# EAGLE design OPEnS-Power-7.2 (EAGLE 9.3.1)
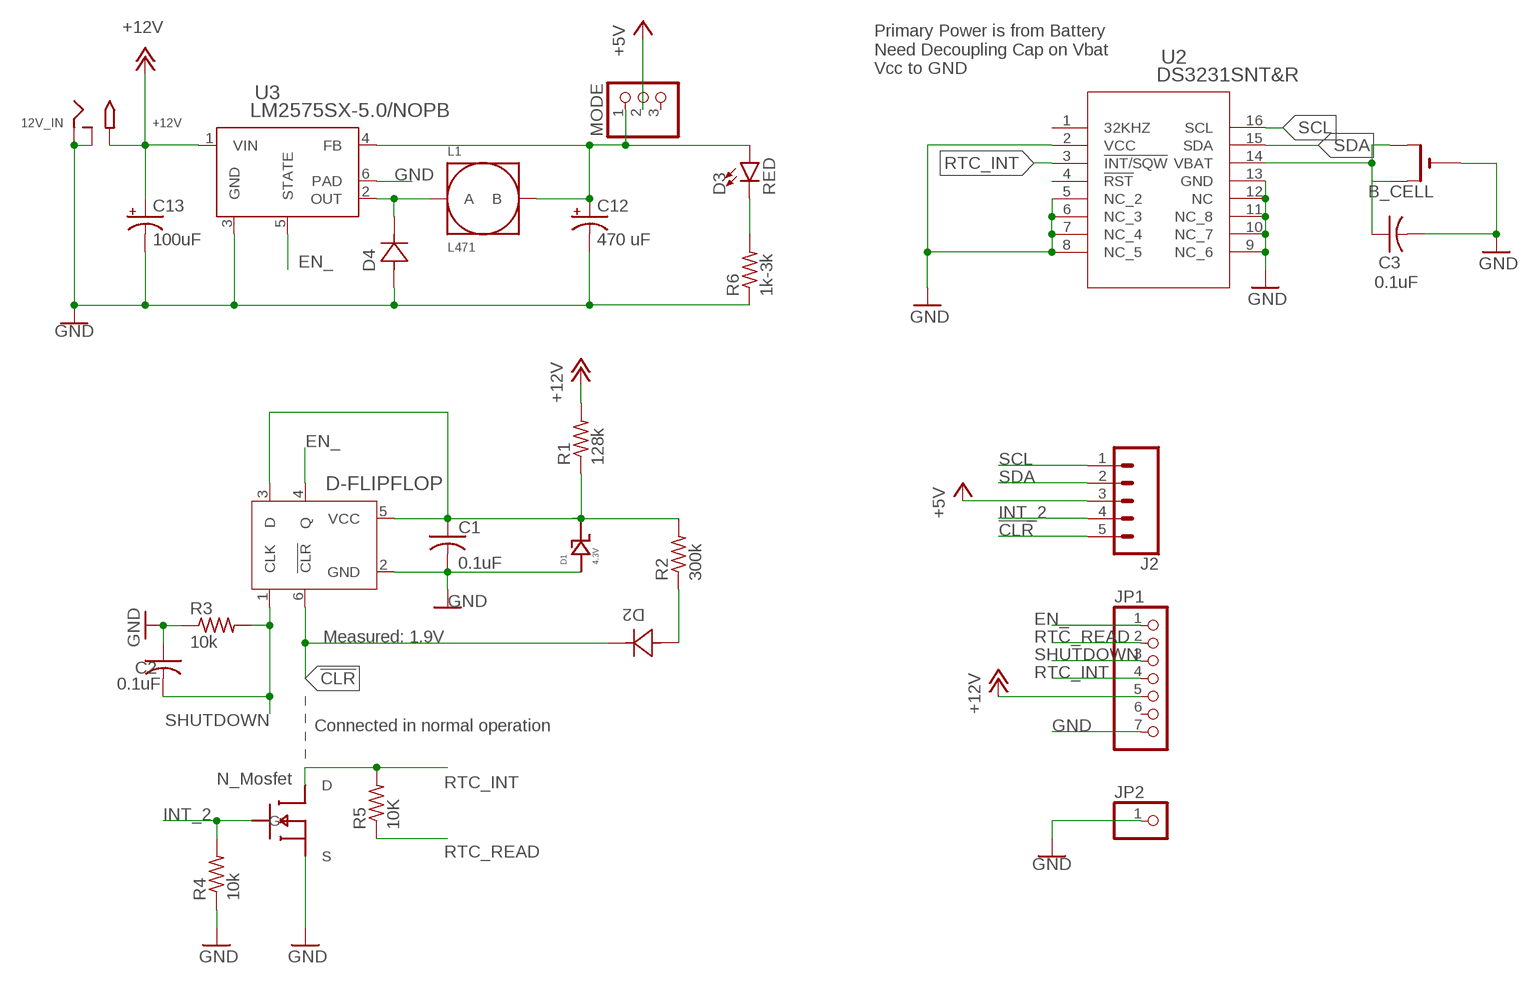
[diagram p0: schematic, sheet 1]

## Parts
12V_IN  2.1MMJACKSMT  [DCJACK_2MM_SMT]
B_CELL  CR1220SMT  [CR1220-SMD]
C1  0.1uF  C-USC1206  [C1206]
C2  0.1uF  C-USC1206  [C1206]
C3  0.1uF  C-USC1206  [C1206]
C12  470 uF  CPOL-US153CLV-0810  [153CLV-0810]
C13  100uF  CPOL-US153CLV-0505  [153CLV-0505]
D1  4.3V  ZENER-DO219  [DO-219AC]
D2  S1A-13-F  [SMA]
D3  RED  LED-RED1206  [LED-1206]
D4  S1A-13-F  [SMA]
D-FLIPFLOP  SN74LVC1G175DBVR  [DBV6]
J2  CONN_05  [1X05]
JP1  PINHD-1X7  [1X07]
JP2  PINHD-1X1  [1X01]
L1  L471  [12-12]
MODE  PINHD-1X3  [1X03]
MOSFET  MOSFET-SOT23F  [SOT-23F]
R1  128k  R-US_R1206  [R1206]
R2  300k  R-US_R1206  [R1206]
R3  10k  R-US_R1206  [R1206]
R4  10k  R-US_R1206  [R1206]
R5  10K  R-US_R1206  [R1206]
R6  1k-3k  R-US_R1206  [R1206]
U2  DS3231SNT&R  [21-0042B_16]
U3  LM2575SX-5.0/NOPB  [KTT0005B]

## Nets
5_RAW [5v]: C12.+ D3.A L1.B MODE.1 U3.4(FB)
!CLR [sig]: D2.1 D-FLIPFLOP.6(!CLR) J2.5
+5V [5v]: J2.3 MODE.2
+12V: 12V_IN.PWR2(TIP) C13.+ JP1.5 R1.2 U3.1(VIN)
EN_ [sig]: D-FLIPFLOP.4(Q) JP1.1 U3.5(STATE)
GND: 12V_IN.GND(RING) 12V_IN.GNDBREAK(RING_SW) B_CELL.- C1.2 C2.1 C3.2 C12.- C13.- D1.BCK D4.2 D-FLIPFLOP.2(GND) JP1.7 JP2.1 MOSFET.S R3.1 R4.1 R6.1 U2.2(VCC) U2.5(NC_2) U2.6(NC_3) U2.7(NC_4) U2.8(NC_5) U2.9(NC_6) U2.10(NC_7) U2.11(NC_8) U2.12(NC) U2.13(GND) U3.3(GND) U3.6(PAD)
INT_2: J2.4 MOSFET.G R4.2
N$1 [5v]: D4.1 L1.A U3.2(OUT)
N$2 [sig]: C1.1 D1.FNT D-FLIPFLOP.3(D) D-FLIPFLOP.5(VCC) R1.1 R2.2
N$3: B_CELL.+$1(+) B_CELL.+$2(+1) C3.1 U2.14(VBAT)
N$4 [sig]: D2.2 R2.1
N$7: D3.C R6.2
RTC_INT [sig]: JP1.4 MOSFET.D R5.2 U2.3(!INT/SQW)
RTC_READ: JP1.2 R5.1
SCL: J2.1 U2.16(SCL)
SDA: J2.2 U2.15(SDA)
SHUTDOWN [sig]: C2.2 D-FLIPFLOP.1(CLK) JP1.3 R3.2
Unconnected: JP1.6 MODE.3 U2.1(32KHZ) U2.4(!RST)

## Notes on the sheet
- Primary Power is from Battery
  Need Decoupling Cap on Vbat
  Vcc to GND
- Measured: 1.9V
- Connected in normal operation
- N_Mosfet

## Library data of the parts
12V_IN = adafruit:2.1MMJACK: 2.1mm x 5.5mm THM DC jack with internal switch. Digikey part #PJ-102A, 4UCON part #05537 2.1mm x 5.5mm SMT DC jack with internal switch. Digikey part #PJ-002A-SMT, 4UCON part #03267 By microbuilder.eu & adafruit.com
B_CELL = adafruit:CR1220: CR1216/CR1220/CR1225 12mm 3V lithium coin cell Great for battery packup. Both SMT and THM holders. Note the THM package has the ground pads on both sides of the PCB so that the masks are the same - this reduces the cost
C1-C3 = adafruit:C-US: CAPACITOR, American symbol
C12 = rcl:CPOL-US: POLARIZED CAPACITOR, American symbol; SPICEPREFIX: C
C13 = adafruit:CPOL-US: POLARIZED CAPACITOR, American symbol
D1 = beach:ZENER-DO219
D2 D4 = eDNA:S1A-13-F: General SMD diode 50V 1A https://www.digikey.com/product-detail/en/diodes-incorporated/S1A-13-F/S1A-FDICT-ND/750031; MANUFACTURER_PART_NUMBER: S1A13F; VENDOR: Diodes Inc
D3 = SparkFun-LED:LED-RED: Red SMD LED Used in manufacturing of most products at SparkFun Packages: 0603 - SMD 0603 package [Product Link] <http://docs.avagotech.com/docs/AV02-0551EN> 0603 SMART - SMD 0603 SMART package ( more efficient and expensive)[Product Link] <http://www.osram-os.com/Graphics/XPic2/00077099_0.pdf> 1206 - SMD1206 package [Product Link] <https://www.sparkfun.com/datasheets/DevTools/LilyPad/Q150OVS4.pdff> SparkFun Products: Pro Mini 328 -5V <https://www.sparkfun.com/products/821> RedBoard <https://www.sparkfun.com/products/12757> IOIO-OTG <https://www.sparkfun.com/products/13613>; PROD_ID: DIO-09912
D-FLIPFLOP = eDNA:SN74LVC1G175DBVR: D Flipflop with clear - https://www.digikey.com/product-detail/en/texas-instruments/SN74LVC1G175DBVR/296-17617-1-ND/706599; MANUFACTURER_PART_NUMBER: SN74LVC1G175DBVR; VENDOR: Texas Instruments
J2 = SparkFun-Connectors:CONN_05: Multi connection point. Often used as Generic Header-pin footprint for 0.1 inch spaced/style header connections On any of the 0.1 inch spaced packages, you can populate with these: Break Away Headers - Straight <https://www.sparkfun.com/products/116> (PRT-00116) Break Away Male Headers - Right Angle <https://www.sparkfun.com/products/553> (PRT-00553) Female Headers <https://www.sparkfun.com/products/115> (PRT-00115) Break Away Headers - Machine Pin <https://www.sparkfun.com/products/117> (PRT-00117) Break Away Female Headers - Swiss Machine Pin <https://www.sparkfun.com/products/743> (PRT-00743) For SCREWTERMINALS and SPRING TERMINALS visit here: Screw Terimnals on SparkFun.com <https://www.sparkfun.com/search/results?term=Screw+Terminals> (5mm/3.5mm/2.54mm spacing) This device is also useful as a general connection point to wire up your design to another part of your project. Our various solder wires solder well into these plated through hole pads. Hook-Up Wire - Assortment (Stranded, 22 AWG) <https://www.sparkfun.com/products/11375> (PRT-11375) Hook-Up Wire - Assortment (Solid Core, 22 AWG) <https://www.sparkfun.com/products/11367> (PRT-11367) View the entire wire category on our website here <https://www.sparkfun.com/categories/141> Special notes: Molex polarized connector foot print use with SKU : PRT-08231 with associated crimp pins and housings. 1MM SMD Version SKU: PRT-10208
JP1 = pinhead:PINHD-1X7: PIN HEADER
JP2 = adafruit:PINHD-1X1: Pin header 1x1 for 0.1" spacing With round pins
L1 = LM2575:L471
MODE = pinhead:PINHD-1X3: PIN HEADER
MOSFET = beach:MOSFET-SOT23F
R1-R6 = adafruit:R-US_: RESISTOR, American symbol
U2 = eDNA:DS3231SNT&R: Real-time clock, RTC, DS3231 https://www.digikey.com/products/en?keywords=DS3231SN%23T%26RCT-ND; MANUFACTURER_PART_NUMBER: DS3231SN#T&R; VENDOR: Maxim Integrated Products
U3 = eDNA:LM2575SX-5.0/NOPB; MANUFACTURER_PART_NUMBER: LM2575SX5.0NOPB; VENDOR: Texas Instruments

## Net classes
1 12v: width 0.457 mm, clearance 0.305 mm
2 5v: width 0.406 mm, clearance 0.305 mm
3 sig: width 0.152 mm, clearance 0.152 mm

## Board
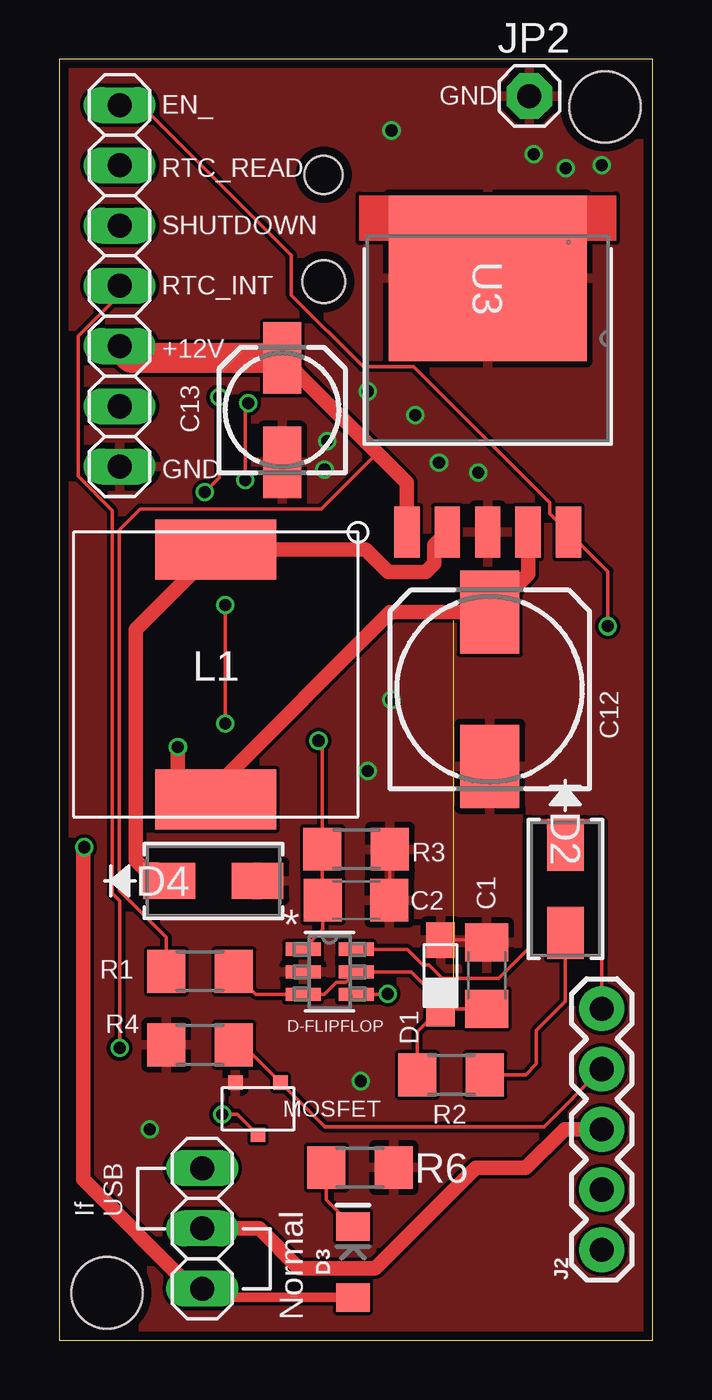
[diagram p1: board, top side]
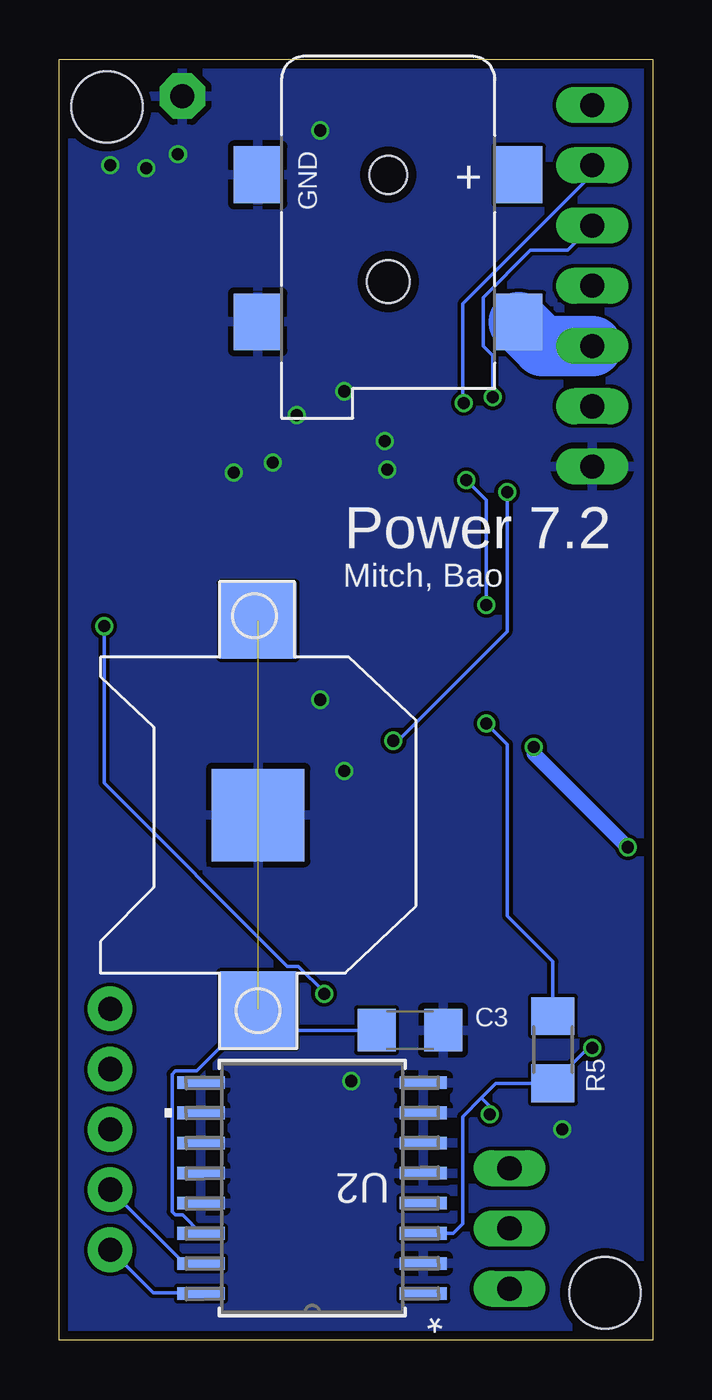
[diagram p2: board, bottom side, seen from below]

Size 25 x 54 mm. Coordinates in mm from the lower left corner, seen from the top.
Outline: 0,0 25,0 25,54 0,54 0,0
Copper layers (1*16): Top 0.035559375mm / dielectric 1.6mm / Bottom 0.035559375mm
Design rules "oshpark-2layer": minimum track width 6mil, minimum drill 10mil, track to track 6mil, track to pad 6mil, pad to pad 6mil, via to via 6mil, smd to smd 6mil, copper to edge 15mil, drill to drill 6mil, minimum pad ring 5mil, minimum via ring 5mil, stop-mask expansion 2.5mil, vias tented up to drill 0mil, thermal gap 10mil
Holes 3 mm at 23,52 2,2

### Footprints (pad centres in the part's own frame; a part is rotated, then mirrored left to right if it is on the bottom)
DCJACK_2MM_SMT = smd 2.4 x 2: GND 0,-5.5; GNDBREAK 6.2,-5.5; PWR1 0,5.5; PWR2 6.2,5.5 | hole 1.6: 0,0 | hole 1.8: 4.5,0
CR1220-SMD = smd 3.2 x 3.2: +$1 -8.2,0; +$2 8.2,0 | smd 3.9 x 3.9: - 0,0
C1206 = smd 1.6 x 1.8: 1 -1.4,0; 2 1.4,0
153CLV-0810 = smd 3.5 x 2.5: + 3.25,0; - -3.25,0
153CLV-0505 = smd 3 x 1.6: + 2.2,0; - -2.2,0
DO-219AC = smd 1.5 x 1.2: BCK 2.9,0; FNT 0,0
SMA = smd 2.18 x 1.528: 1 -1.857,0; 2 1.857,0
LED-1206 = smd 1.2 x 1.4: A -1.5,0; C 1.5,0
DBV6 = smd 1.473 x 0.559: 1 -1.118,0.95; 2 -1.118,0; 3 -1.118,-0.95; 4 1.118,-0.95; 5 1.118,0; 6 1.118,0.95
1X05 = drill 1.016 pad 1.88: 1 0,0; 2 2.54,0; 3 5.08,0; 4 7.62,0; 5 10.16,0
1X07 = drill 1.016 long: 1 -7.62,0; 2 -5.08,0; 3 -2.54,0; 4 0,0; 5 2.54,0; 6 5.08,0; 7 7.62,0
1X01 = drill 1.016 pad 1.93 octagon: 1 0,0
12-12 = smd 5.08 x 2.54: A 0,-5.27; B 0,5.27
1X03 = drill 1.016 long: 1 -2.54,0; 2 0,0; 3 2.54,0
SOT-23F = smd 0.6 x 0.6: D 0,1.1; G -0.95,-1.1; S 0.95,-1.1
R1206 = smd 1.6 x 1.803: 1 -1.422,0; 2 1.422,0
21-0042B_16 = smd 1.981 x 0.533: 1 -4.686,4.445; 2 -4.686,3.175; 3 -4.686,1.905; 4 -4.686,0.635; 5 -4.686,-0.635; 6 -4.686,-1.905; 7 -4.686,-3.175; 8 -4.686,-4.445; 9 4.686,-4.445; 10 4.686,-3.175; 11 4.686,-1.905; 12 4.686,-0.635; 13 4.686,0.635; 14 4.686,1.905; 15 4.686,3.175; 16 4.686,4.445
KTT0005B = smd 2.159 x 1.067: 1 8.153,-3.404; 2 8.153,-1.702; 3 8.153,0; 4 8.153,1.702; 5 8.153,3.404 | smd 6.985 x 8.331: 6 -2.54,0

### Placement (x,y rotation side)
12V_IN  11.14,49.13 270 bottom
B_CELL  16.62,22.14 90 bottom
C1  18.01,15.38 90 top
C2  12.51,18.55 180 top
C3  10.22,13.07 0 bottom
C12  18.14,27.44 90 top
C13  9.39,39.21 90 top
D1  16.07,13.97 90 top
D2  21.33,19.02 270 top
D3  12.38,3.3 90 top
D4  6.49,19.36 0 top
D-FLIPFLOP  11.39,15.53 0 top
J2  22.86,3.81 90 top
JP1  2.54,44.45 270 top
JP2  19.81,52.45 0 top
L1  6.59,28.07 180 top
MODE  6.03,4.71 90 top
MOSFET  8.37,9.76 180 top
R1  5.93,15.55 180 top
R2  16.51,11.19 180 top
R3  12.51,20.7 180 top
R4  5.93,12.45 0 top
R5  4.2,12.24 270 bottom
R6  12.67,7.28 180 top
U2  14.34,6.41 180 bottom
U3  18.05,42.23 270 top

### Tracks (layer width: path | path; a pad name or v marks a point on that pad's centre or on a via)
5_RAW  (via drill 0.51)
  Top 0.406: D3.A 6.39,1.8 MODE.1
  Top 0.61: U3.4 19.75,32.3 C12.+ 13.95,30.69 6.63,23.37 | L1.B 6.9,23.1 6.63,23.37 | 6.63,23.37 6.13,22.87 5.13,22.87 5,23 v5,25 | MODE.1 5.61,2.17 1,6.78 1,20.74 v1.05,20.78
  Bottom 0.61: v5,25 5,24.73 v1.05,20.78
!CLR
  Top 0.152: D-FLIPFLOP.6 14.66,16.48 15.32,15.81 15.58,15.81 16.14,15.26 18.52,15.26 19.77,16.5 19.77,21.83 19.86,21.92 20.52,21.92 20.61,21.83 20.61,21.59 D2.1 22.04,21.59 22.04,21.83 22.13,21.92 22.8,21.92 22.89,21.83 22.89,16.22 22.86,16.19 J2.5
+5V
  Top 0.61: MODE.2 8.42,4.71 10.1,3.03 13.32,3.03 17.55,7.26 19.66,7.26 21.29,8.89 J2.3
+12V
  Top 0.152: R1.2 4.51,16.98 2.54,18.95 2.54,34.16 3.42,35.05 11.05,35.05 13.4,37.4
  Top 0.61: C13.+ 13.4,37.4 14.65,36.16 U3.1
  Top 1.27: C13.+ 3.04,41.41 JP1.5
  Bottom 2.54: 12V_IN.PWR2 4.62,41.91 JP1.5
EN_  (via drill 0.51)
  Top 0.152: D-FLIPFLOP.4 13.82,14.58 v13.84,14.61 | v23.11,30.1 23.11,32.41 U3.5 20.67,34.86 20.67,35.31 14.93,41.04 12.81,41.04 9.78,44.07 9.78,45.74 3.46,52.07 JP1.1
  Bottom 0.152: v23.11,30.1 23.11,23.5 15.39,15.77 14.93,15.77 13.84,14.69 v13.84,14.61
GND  (via drill 0.51)
  Top 0.152: D1.BCK 17.92,16.87 C1.2 | R3.1 13.93,18.57 C2.1
  other vias: 11.29,37.9 11.18,36.7 14,27 13,24 20,50 14,51 13,40 15,39 16,37 17.65,36.58 21.34,49.4 22.86,49.53 3.81,8.89 12.7,10.92
  pour Top: 0,54 25,54 25,0 0,0
  pour Bottom: 0,54 25,54 25,0 0,0
INT_2
  Top 0.152: R4.2 7.73,12.45 MOSFET.G 11.18,9 20.43,9 J2.4
N$1
  Top 0.61: U3.2 15.79,33.51 15.79,32.74 15.43,32.38 13.86,32.38 12.91,33.34 L1.A 3.22,29.96 3.22,20.22 3.59,19.85 4.15,19.85 D4.1
N$2
  Top 0.152: R1.1 7.35,15.51 8.28,14.58 D-FLIPFLOP.3 11.17,14.58 11.68,15.09 12.07,15.09 D-FLIPFLOP.5 14.82,15.53 16.07,14.29 D1.FNT | D1.FNT C1.1 | R2.2 15.09,13 D1.FNT
N$3  (1 unrouted)
  Bottom 0.152: C3.1 15.75,13.07 B_CELL.+$1 | B_CELL.+$1 16.62,13.43 | U2.14 19.8,5.28 20.11,5.28 20.25,5.41 20.25,11.22 20.11,11.35 19.21,11.35 B_CELL.+$1
N$4
  Top 0.152: D2.2 21.33,14.28 20.11,13.05 20.11,11.64 19.65,11.19 R2.1
N$7
  Top 0.152: R6.2 11.25,5.93 D3.C
RTC_INT  (via drill 0.51)
  Top 0.152: MOSFET.D 7.5,9.53 v6.86,9.53 | JP1.4 2.54,44.07 0.79,42.32 0.79,36.42 2.23,34.98 2.23,18.83 2.54,18.52 v2.54,12.32
  Bottom 0.152: 7.21,10.21 8,9.42 8,4.9 8.4,4.5 U2.3 | 7.21,10.21 6.6,10.82 R5.2 2.7,12.32 v2.54,12.32 | v6.86,9.53 6.86,9.86 7.21,10.21
RTC_READ  (via drill 0.51)
  Top 0.152: v7.96,39.51 7.84,39.4 v7.84,36.26 | v7,31 v7,26
  Bottom 0.152: R5.1 4.2,15.97 6.12,17.88 6.12,25.12 v7,26 | JP1.2 2.54,49.15 8,43.7 8,39.55 v7.96,39.51 | v7.84,36.26 7,35.42 v7,31
SCL
  Bottom 0.152: U2.16 19.06,2 21.05,2 J2.1
SDA
  Bottom 0.152: U2.15 19.75,3.23 J2.2
SHUTDOWN  (via drill 0.51)
  Top 0.152: D-FLIPFLOP.1 11.11,17.32 C2.2 11.09,18.57 R3.2 11.09,25.11 v10.92,25.27 | v6.73,39.75 6.73,36.36 v6.13,35.76
  Bottom 0.152: JP1.3 3.58,45.95 5.14,45.95 7.14,43.95 7.14,41.91 6.73,41.5 v6.73,39.75 | v6.13,35.76 6.13,29.87 10.73,25.27 v10.92,25.27

### Text on the board
tPlace: EN_ | GND | RTC_READ | SHUTDOWN | RTC_INT | +12V | GND | If / USB | Normal
bPlace: Power 7.2 | Mitch, Bao